# EAGLE schematic od3 (EAGLE 8.2.0)
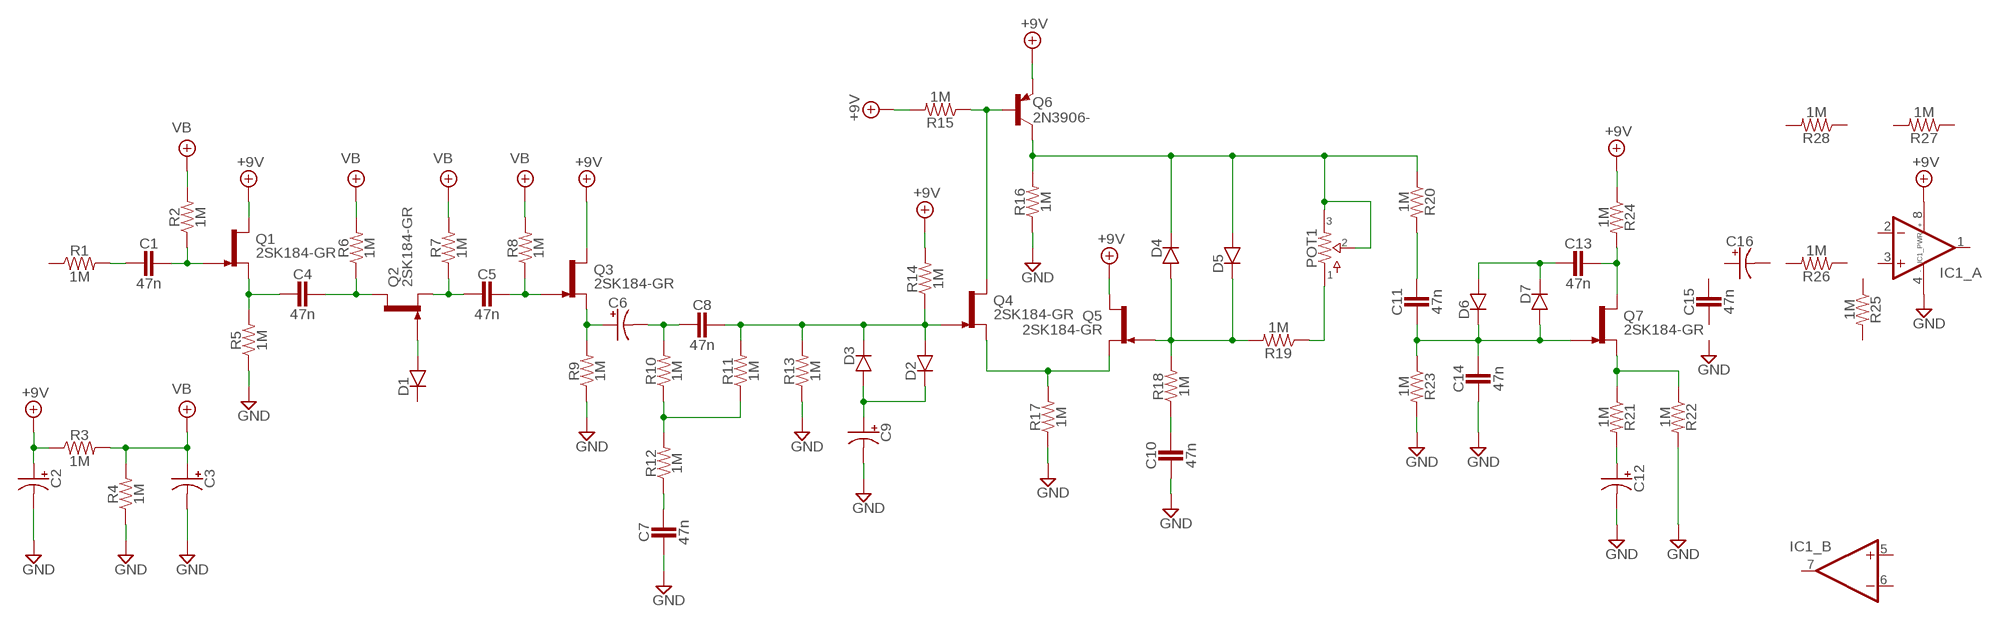
[diagram p0: schematic, sheet 1]

## Parts
C1  47n  CER/FILMBOX.1  [BOX_SMALL]
C2  0500  [050_020]
C3  0500  [050_020]
C4  47n  CER/FILMBOX.1  [BOX_SMALL]
C5  47n  CER/FILMBOX.1  [BOX_SMALL]
C6  0500  [050_020]
C7  47n  CER/FILMBOX.1  [BOX_SMALL]
C8  47n  CER/FILMBOX.1  [BOX_SMALL]
C9  0500  [050_020]
C10  47n  CER/FILMBOX.1  [BOX_SMALL]
C11  47n  CER/FILMBOX.1  [BOX_SMALL]
C12  0500  [050_020]
C13  47n  CER/FILMBOX.1  [BOX_SMALL]
C14  47n  CER/FILMBOX.1  [BOX_SMALL]
C15  47n  CER/FILMBOX.1  [BOX_SMALL]
C16  0500  [050_020]
D1  DO35.2  [DO35-2]
D2  DO35.2  [DO35-2]
D3  DO35.2  [DO35-2]
D4  DO35.2  [DO35-2]
D5  DO35.2  [DO35-2]
D6  DO35.2  [DO35-2]
D7  DO35.2  [DO35-2]
IC1  DUALTH  [DIL0]
POT1  POTS16MM  [16MM]
Q1  2SK184-GR  2N3819TO-92S  [TO92-]
Q2  2SK184-GR  2N3819TO-92S  [TO92-]
Q3  2SK184-GR  2N3819TO-92S  [TO92-]
Q4  2SK184-GR  2N3819TO-92S  [TO92-]
Q5  2SK184-GR  2N3819TO-92S  [TO92-]
Q6  2N3906-  [TO92-]
Q7  2SK184-GR  2N3819TO-92S  [TO92-]
R1  1M  R_.3B  [R0207/3]
R2  1M  R_.3B  [R0207/3]
R3  1M  R_.3B  [R0207/3]
R4  1M  R_.3B  [R0207/3]
R5  1M  R_.3B  [R0207/3]
R6  1M  R_.3B  [R0207/3]
R7  1M  R_.3B  [R0207/3]
R8  1M  R_.3B  [R0207/3]
R9  1M  R_.3B  [R0207/3]
R10  1M  R_.3B  [R0207/3]
R11  1M  R_.3B  [R0207/3]
R12  1M  R_.3B  [R0207/3]
R13  1M  R_.3B  [R0207/3]
R14  1M  R_.3B  [R0207/3]
R15  1M  R_.3B  [R0207/3]
R16  1M  R_.3B  [R0207/3]
R17  1M  R_.3B  [R0207/3]
R18  1M  R_.3B  [R0207/3]
R19  1M  R_.3B  [R0207/3]
R20  1M  R_.3B  [R0207/3]
R21  1M  R_.3B  [R0207/3]
R22  1M  R_.3B  [R0207/3]
R23  1M  R_.3B  [R0207/3]
R24  1M  R_.3B  [R0207/3]
R25  1M  R_.3B  [R0207/3]
R26  1M  R_.3B  [R0207/3]
R27  1M  R_.3B  [R0207/3]
R28  1M  R_.3B  [R0207/3]

## Nets
+9V: C2.+ IC1.8(_PWR:V+) Q1.3(D) Q3.3(D) Q5.3(D) Q6.3(E) R3.1 R14.2 R15.2 R24.1
GND: C2.- C3.- C7.2 C9.- C10.2 C12.- C14.2 IC1.4(_PWR:V-) R4.1 R5.1 R9.1 R13.1 R16.1 R17.1 R22.2 R23.2
N$1: C9.+ D2.C D3.A
N$2: Q4.3(D) Q6.2(B) R15.1
N$3: C1.2 R1.2
N$4: C1.1 Q1.2(G) R2.1
N$5: C4.2 Q1.1(S) R5.2
N$6: C4.1 Q2.3(D) R6.1
N$7: C5.2 Q2.1(S) R7.1
N$8: C5.1 Q3.2(G) R8.1
N$9: D1.A Q2.2(G)
N$10: C6.+ Q3.1(S) R9.2
N$11: C6.- C8.2 R10.2
N$12: R10.1 R11.1 R12.2
N$13: C8.1 D2.A D3.C Q4.2(G) R11.2 R13.2 R14.1
N$14: C7.1 R12.1
N$15: D4.C D5.A POT1.2 POT1.3 Q6.1(C) R16.2 R20.1
N$16: Q4.1(S) Q5.1(S) R17.2
N$17: D4.A D5.C Q5.2(G) R18.2 R19.2
N$18: C10.1 R18.1
N$19: POT1.1 R19.1
N$21: C11.1 R20.2
N$22: C11.2 C14.1 D6.C D7.A Q7.2(G) R23.1
N$23: C13.1 Q7.3(D) R24.2
N$24: C13.2 D6.A D7.C
N$25: C12.+ R21.2
N$26: Q7.1(S) R21.1 R22.1
VB: C3.+ R2.2 R3.2 R4.2 R6.2 R7.2 R8.2
Unconnected: C15.1 C15.2 C16.+ C16.- D1.C IC1.1(_A:OUT) IC1.2(_A:-IN) IC1.3(_A:+IN) IC1.5(_B:+IN) IC1.6(_B:-IN) IC1.7(_B:OUT) R1.1 R25.1 R25.2 R26.1 R26.2 R27.1 R27.2 R28.1 R28.2

## Library data of the parts
C1 C4 C5 C7 C8 C10 C11 C13-C15 = pedals-capacitors-film:CER/FILM: 47 - 120pF Xicon Ceramic Disc 2.5mm lead spacing
C2 C3 C6 C9 C12 C16 = pedals-capacitors-elec:050
D1-D7 = pedals-diodes:DO35: DO-35 Package Diodes: 1N914
IC1 = pedals-integrated circuits:DUAL: OP AMP
POT1 = pedals-potentiometers:POTS
Q1-Q5 Q7 = pedals-transistors:2N3819: N-CHANNEL FET
Q6 = pedals-transistors:2N3906: PNP Transistor
R1-R28 = pedals-resistors:R_